# EAGLE design senseye-2_temple_l (EAGLE 6.5.0)
AUTHOR: Neal Jackson; REV: A; TITLE: senseye-2_temple_l
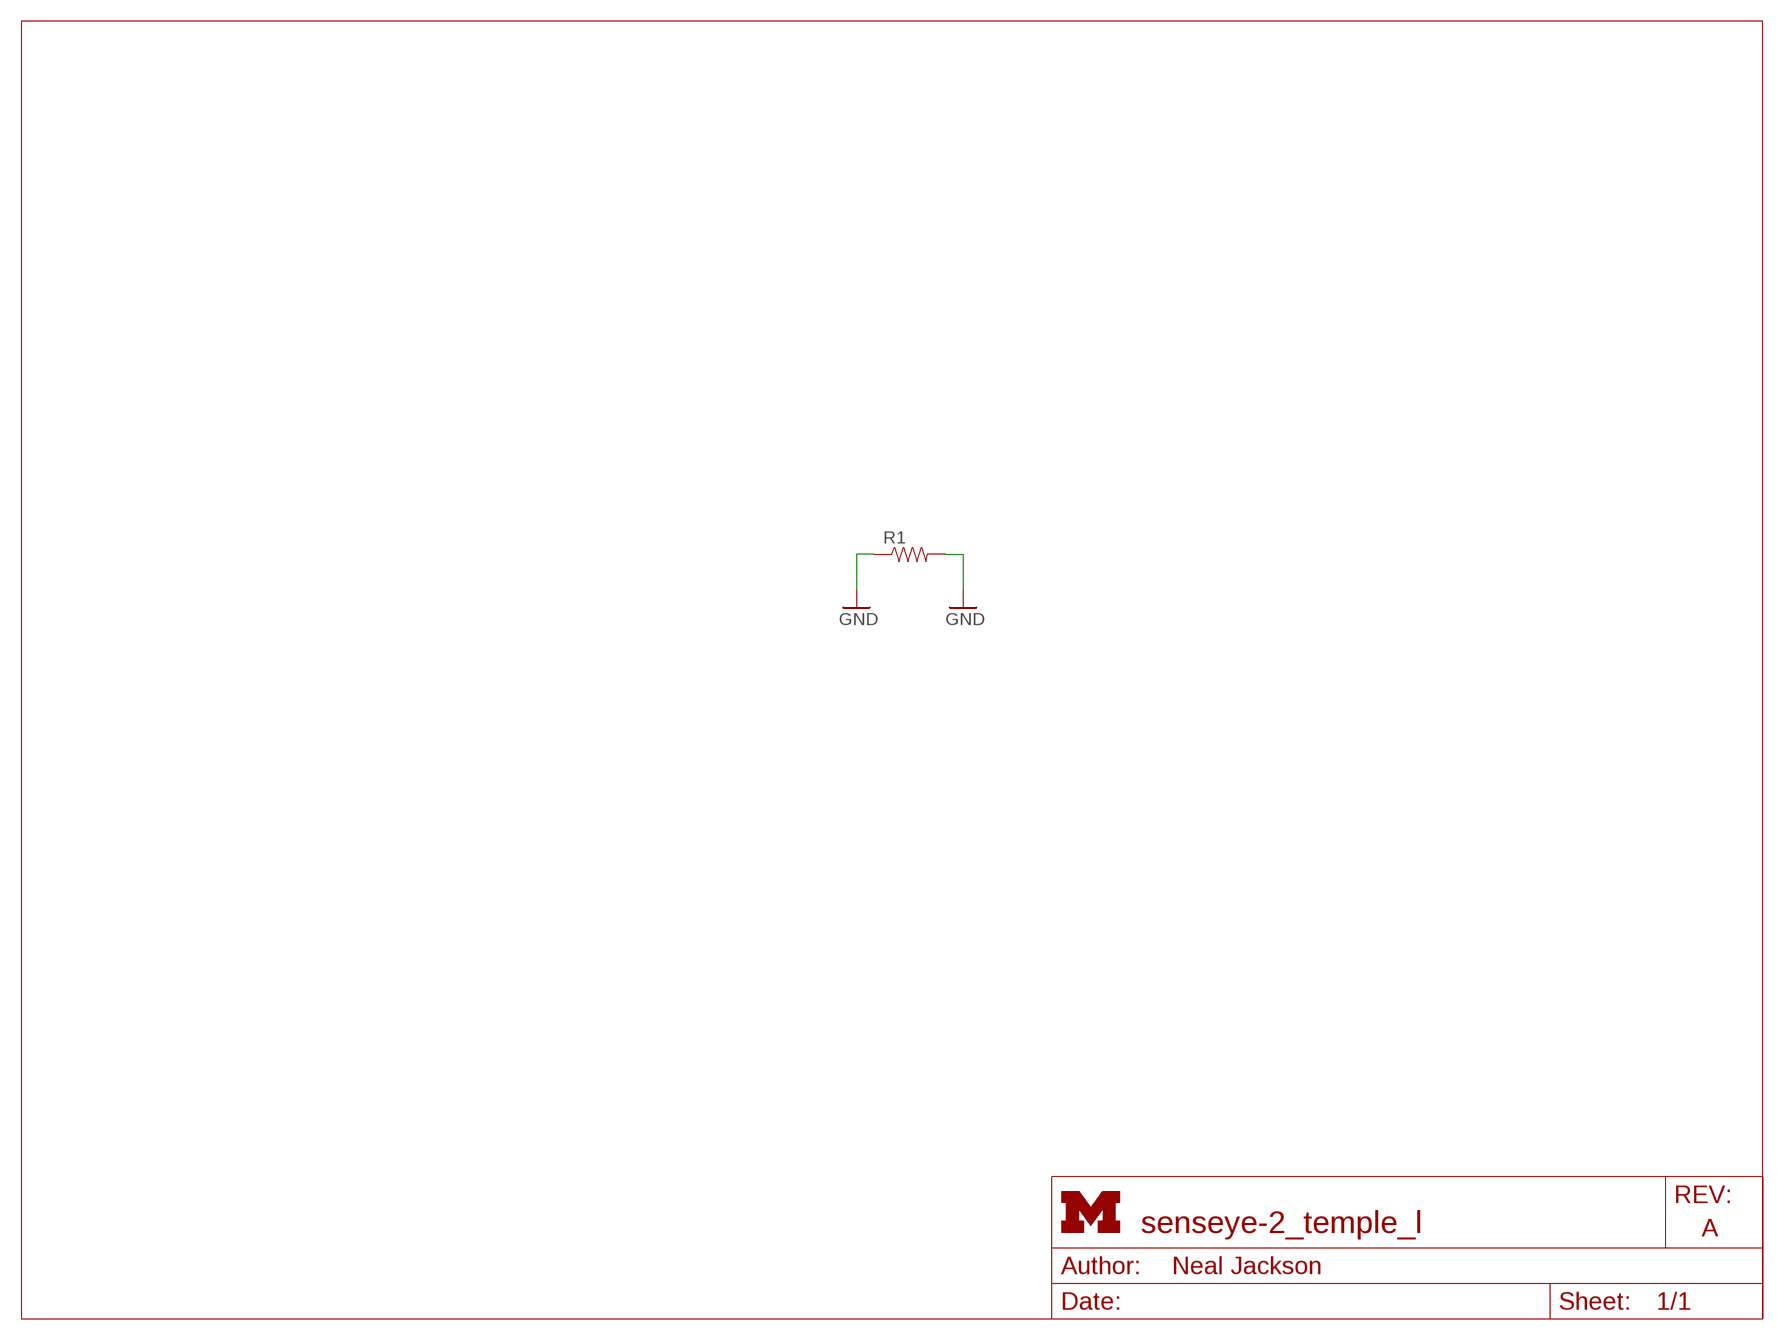
[diagram p0: schematic, sheet 1]
FRAME1 (LETTER_L): HEIGHT: 8.5in; WIDTH: 11in

## Parts
R1  RESISTOR0402_RES  [0402_RES]

## Nets
GND: R1.1 R1.2

## Library data of the parts
R1 = passives:RESISTOR: Resistor Basic schematic elements and footprints for 0603, 1206, and PTH resistors.

## Board
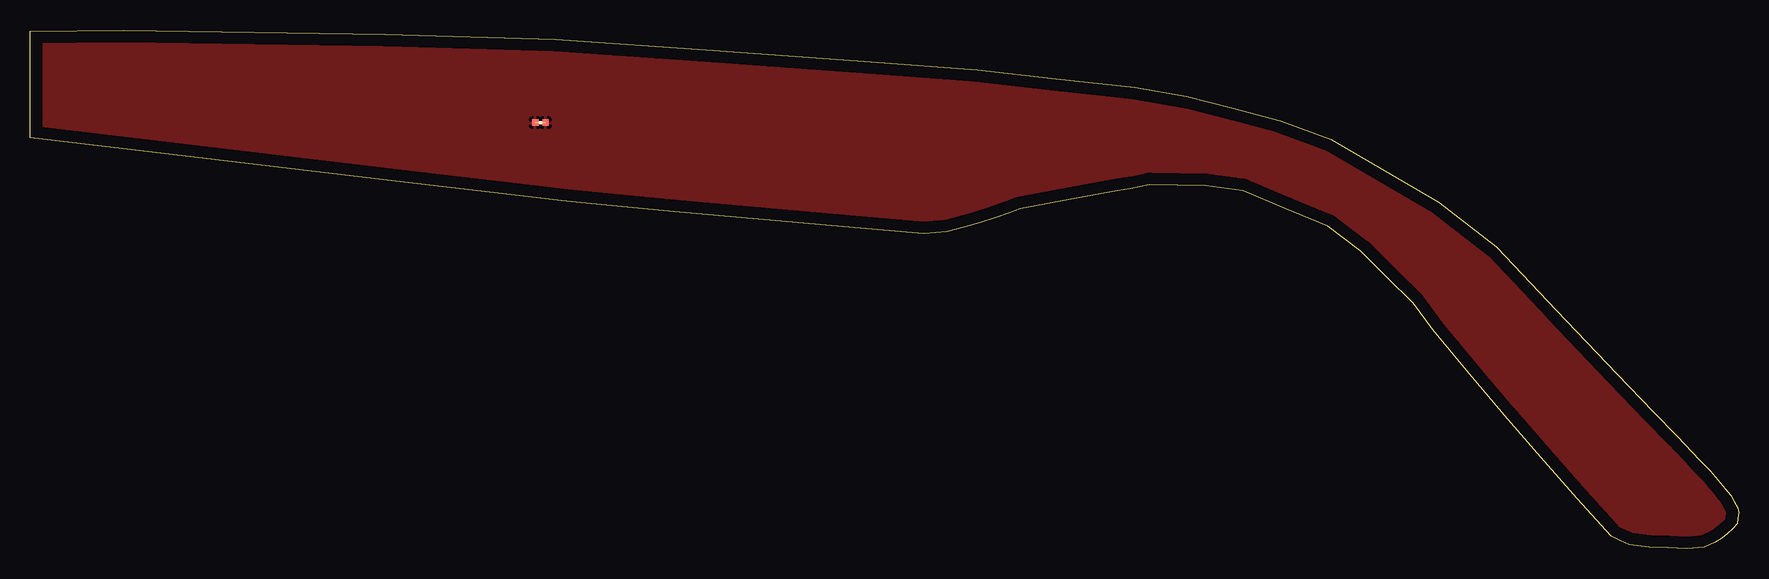
[diagram p1: board, top side]

Size 142.45 x 43.21 mm. Coordinates in mm from the lower left corner, seen from the top.
Outline: 0,43.11 7.82,43.21 29.62,42.84 43.8,42.43 56.95,41.51 70.09,40.58 78.97,39.88 85.54,39.16 92.11,38.43 96.38,37.69 100.31,36.67 104.24,35.66 108.46,34.1 117.45,28.84 122.21,25.14 127.24,19.84 132.27,14.54 135.31,11.4 137.26,9.38 139.2,7.37 140.05,6.5 140.69,5.75 141.32,4.99 141.78,4.42 142.06,3.92 142.35,3.42 142.45,2.99 142.37,2.53 142.3,2.08 141.93,1.63 141.47,1.24 141.02,0.85 140.47,0.53 140.02,0.31 139.57,0.09 138.09,0 136.53,0.05 134.97,0.11 133.33,0.3 132.57,0.67 131.81,1.03 128.96,4.14 125.96,7.59 122.95,11.04 119.78,14.83 118.36,16.53 116.95,18.23 115.3,20.44 113.11,22.6 110.93,24.75 108.2,26.85 104.65,28.33 101.09,29.81 98,30.24 95.66,30.28 93.32,30.32 91.74,29.97 91.2,29.89 90.66,29.8 88.61,29.44 86.58,29.07 84.55,28.69 82.55,28.29 82.12,28.13 81.68,27.97 80.5,27.56 79.18,27.16 77.87,26.77 76.43,26.39 75.48,26.32 74.53,26.24 67.77,26.8 60.73,27.42 53.69,28.05 46.37,28.75 44.3,28.99 42.23,29.22 31.2,30.52 20.7,31.77 10.19,33.01 0,34.22 0,43.11
Copper layers (1*16): Top 0.035mm / dielectric 1.5mm / Bottom 0.035mm
Design rules "default": minimum track width 10mil, minimum drill 24mil, track to track 8mil, track to pad 8mil, pad to pad 8mil, via to via 8mil, smd to smd 8mil, copper to edge 40mil, drill to drill 8mil, minimum pad ring 10mil, minimum via ring 8mil, stop-mask expansion 4mil, vias tented up to drill 0mil, thermal gap 10mil

### Footprints (pad centres in the part's own frame; a part is rotated, then mirrored left to right if it is on the bottom)
0402_RES = smd 0.536 x 0.546: 1 -0.433,0; 2 0.433,0

### Placement (x,y rotation side)
R1  42.55,35.49 0 top

### Tracks (layer width: path | path; a pad name or v marks a point on that pad's centre or on a via)
GND  (1 unrouted)
  pour Top: -0.32,43.43 142.88,43.43 142.88,-0.38 -0.32,-0.38